# EAGLE design wpf-badge (EAGLE 9.3.0)
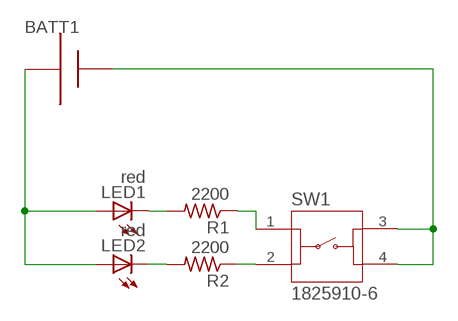
[diagram p0: schematic, sheet 1]

## Parts
BATT1  AAA  [12BH412]
LED1  red  LED3MM  [LED3MM]
LED2  red  LED3MM  [LED3MM]
R1  2200  R-US_0204/7  [0204/7]
R2  2200  R-US_0204/7  [0204/7]
SW1  1825910-6  [SW_1825910-6-4]

## Nets
N$1: LED2.K(C) R2.2
N$2: LED1.K(C) R1.2
N$3: BATT1.+ SW1.3 SW1.4
N$4: R1.1 SW1.1
N$5: R2.1 SW1.2
N$6: BATT1.- LED1.A LED2.A

## Library data of the parts
BATT1 = adafruit:AAA: AAA PC pin holder Mouser part #12BH412 - but pretty much any 1x AAA battery holder should be the same http://www.ladyada.net/library/pcb/eaglelibrary.html
LED1 LED2 = adafruit:LED: LED OSRAM: - CHIPLED LG R971, LG N971, LY N971, LG Q971, LY Q971, LO R971, LY R971 LH N974, LH R974 LS Q976, LO Q976, LY Q976 LO Q996 - Hyper CHIPLED LW Q18S LB Q993, LB Q99A, LB R99A - SideLED LS A670, LO A670, LY A670, LG A670, LP A670 LB A673, LV A673, LT A673, LW A673 LH A674 LY A675 LS A676, LA A676, LO A676, LY A676, LW A676 LS A679, LY A679, LG A679 - Hyper Micro SIDELED® LS Y876, LA Y876, LO Y876, LY Y876 LT Y87S - SmartLED LW L88C, LW L88S LB L89C, LB L89S, LG L890 LS L89K, LO L89K, LY L89K LS L896, LA L896, LO L896, LY L896 - TOPLED LS T670, LO T670, LY T670, LG T670, LP T670 LSG T670, LSP T670, LSY T670, LOP T670, LYG T670 LG T671, LOG T671, LSG T671 LB T673, LV T673, LT T673, LW T673 LH T674 LS T676, LA T676, LO T676, LY T676, LB T676, LH T676, LSB T676, LW T676 LB T67C, LV T67C, LT T67C, LS T67K, LO T67K, LY T67K, LW E67C LS E67B, LA E67B, LO E67B, LY E67B, LB E67C, LV E67C, LT E67C LW T67C LS T679, LY T679, LG T679 LS T770, LO T770, LY T770, LG T770, LP T770 LB T773, LV T773, LT T773, LW T773 LH T774 LS E675, LA E675, LY E675, LS T675 LS T776, LA T776, LO T776, LY T776, LB T776 LHGB T686 LT T68C, LB T68C - Hyper Mini TOPLED® LB M676 - Mini TOPLED Santana® LG M470 LS M47K, LO M47K, LY M47K Source: http://www.osram.convergy.de/
R1 R2 = adafruit:R-US_: RESISTOR, American symbol
SW1 = 1825910-6:1825910-6: Switch Tactile OFF (ON) SPST Round Button PC Pins 0.05A 24VDC 100000Cycles 1.57N Thru-Hole Loose; COMMENT: 1825910-6; CONFIGURATION_POLE-THROW: Single Pole - Single Throw; CONTACT_CURRENT_RATING: 50 mA; DESCRIPTION: FSM4JH=6MM TACT SWITCH, HIGH TEMP; DIGI-KEY_PART_NUMBER: 450-1650-ND; DIGI-KEY_PURCHASE_URL: https://www.digikey.com/product-detail/en/te-connectivity-alcoswitch-switches/1825910-6/450-1650-ND/1632536?utm_source=snapeda&utm_medium=aggregator&utm_campaign=symbol; EU_ROHS_COMPLIANCE: Compliant; MF: TE Connectivity; MP: 1825910-6; PACKAGE: None; TE_PURCHASE_URL: https://www.te.com/usa-en/product-1825910-6.html?te_bu=Cor&te_type=disp&te_campaign=seda_glo_cor-seda-global-disp-prtnr-fy19-seda-model-bom-cta_sma-317_1&elqCampaignId=32493

## Net classes
0 default: width 0.508 mm, drill 0.508 mm, clearance 0.508 mm

## Board
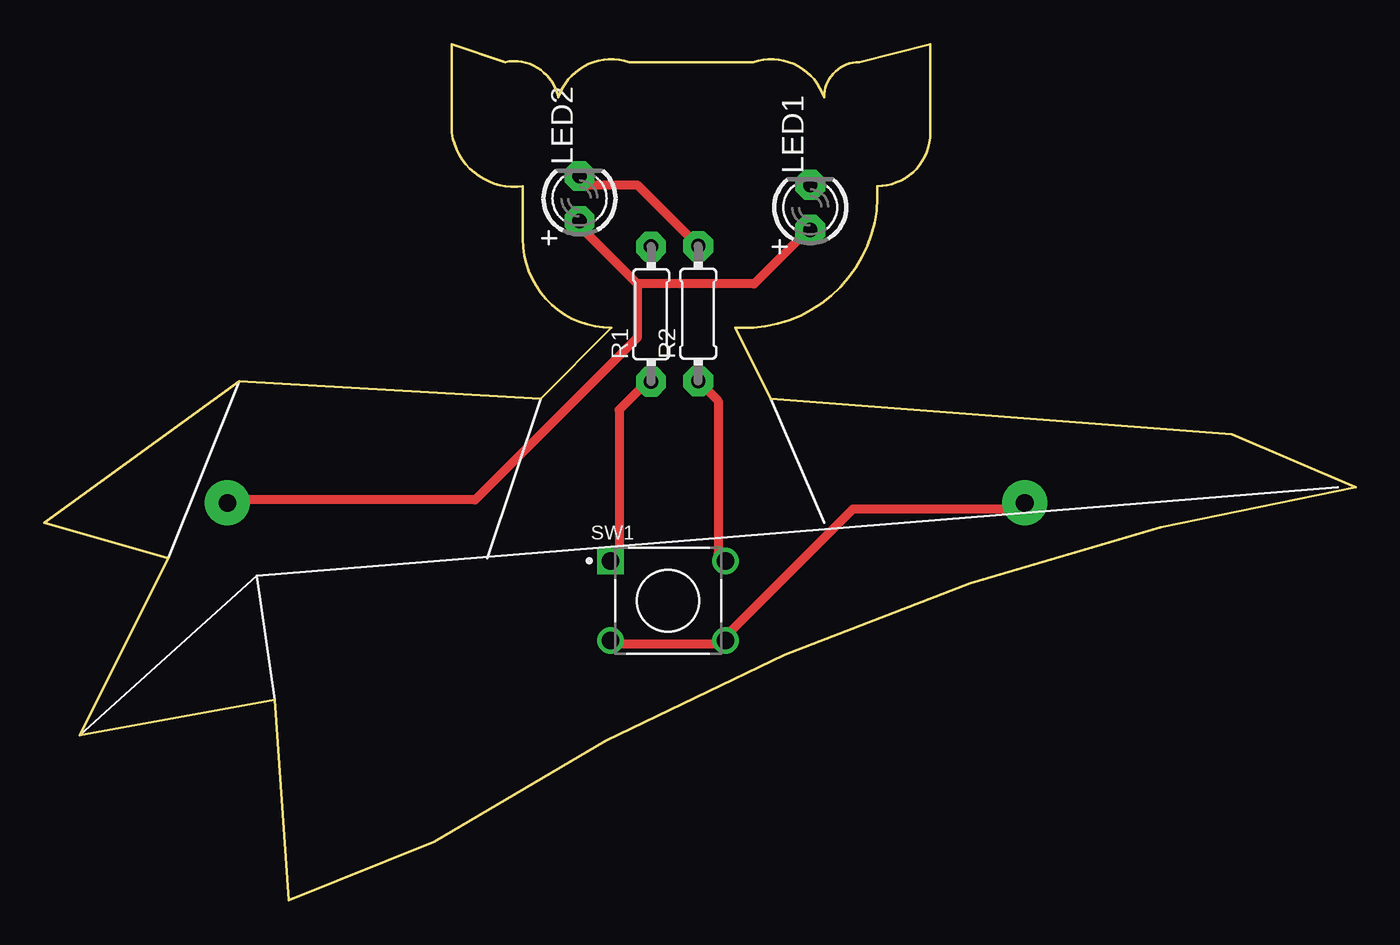
[diagram p1: board, top side]
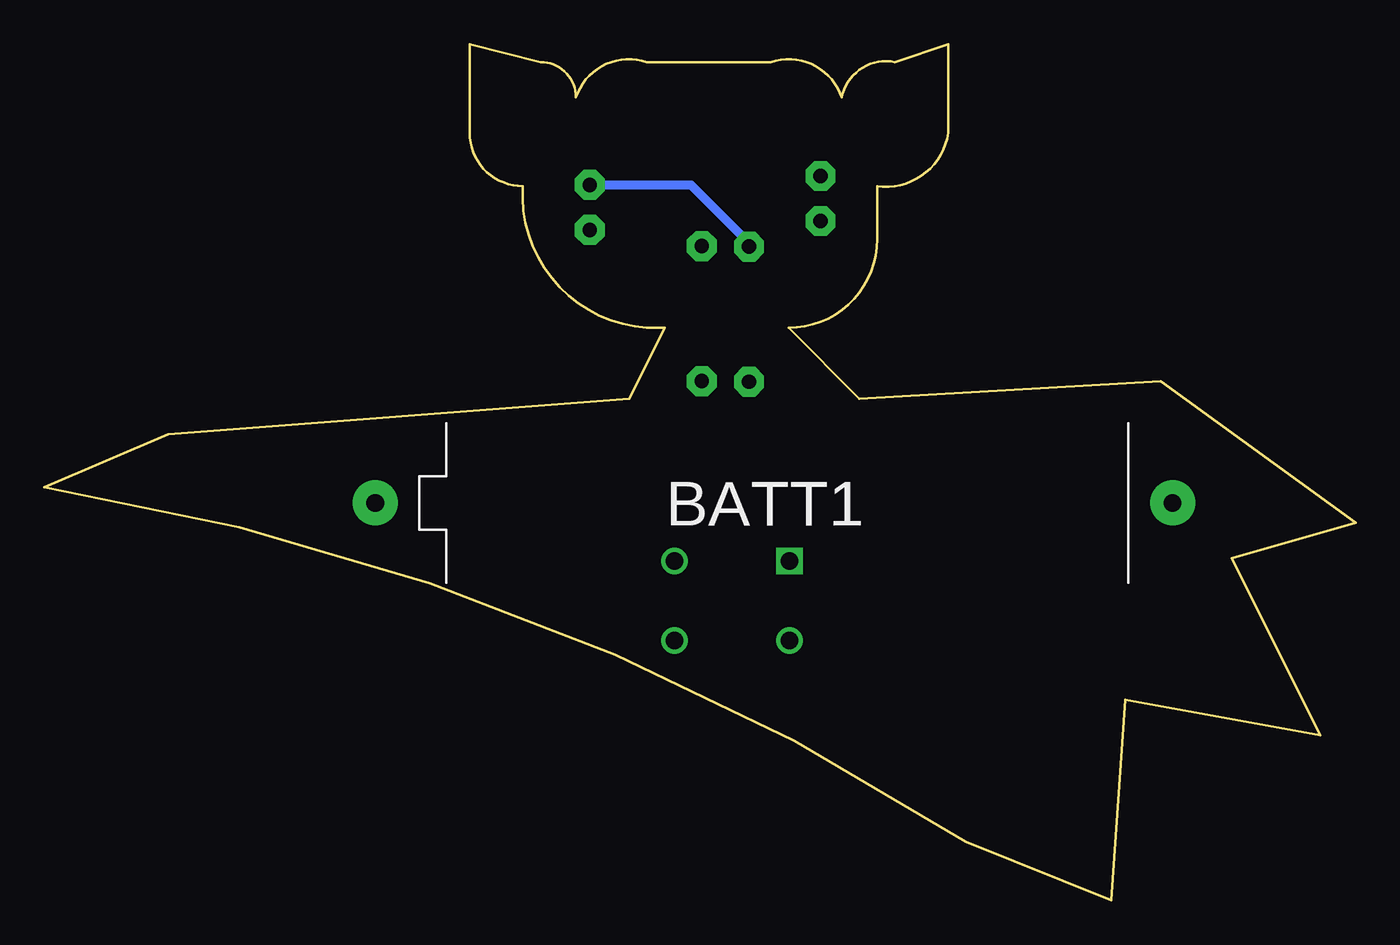
[diagram p2: board, bottom side, seen from below]

Size 74 x 48.3 mm. Coordinates in mm from the lower left corner, seen from the top.
Outline: 13.8,0 22,3.3 arc-24 74,23.3 67,26.3 41,28.3 39,32.3 40,32.3 arc90 47,40.3 arc90 50,43.3 50,48.3 46,47.3 arc90 44,45.3 arc90 40,47.3 33,47.3 arc90 29,45.3 arc90 26,47.3 23,48.3 23,43.3 arc90 27,40.3 27,37.3 arc90 32,32.3 28,28.3 11,29.3 0,21.3 7,19.3 2,9.3 13,11.3 13.8,0
Copper layers (1*16): Top 0.035mm / dielectric 1.5mm / Bottom 0.035mm
Design rules "default": minimum track width 6mil, minimum drill 0.35mm, track to track 6mil, track to pad 6mil, pad to pad 6mil, via to via 6mil, smd to smd 6mil, copper to edge 40mil, drill to drill 6mil, minimum pad ring 10mil, minimum via ring 8mil, stop-mask expansion 4mil, vias tented up to drill 0mil, thermal gap 10mil

### Footprints (pad centres in the part's own frame; a part is rotated, then mirrored left to right if it is on the bottom)
12BH412 = drill 1 pad 2.54: + 22.5,0; - -22.5,0
LED3MM = drill 0.813 pad 1.676 octagon: A -1.27,0; K 1.27,0
0204/7 = drill 0.813 pad 1.676 octagon: 1 -3.81,0; 2 3.81,0
SW_1825910-6-4 = drill 0.99 square: 1 -3.25,2.25 | drill 0.99: 2 3.25,2.25; 3 -3.25,-2.25; 4 3.25,-2.25

### Placement (x,y rotation side)
BATT1  32.83,22.42 180 bottom
LED1  43.22,39.1 90 top
LED2  30.2,39.6 90 top
R1  34.24,33.07 90 top
R2  36.9,33.1 90 top
SW1  35.2,16.9 0 top

### Tracks (layer width: path | path; a pad name or v marks a point on that pad's centre or on a via)
N$1
  Top 0.508: R2.2 36.5,37.32 33.45,40.37 30.4,40.37 LED2.K
N$2
  Bottom 0.508: R1.2 34.46,37.32 37.51,40.37 43.1,40.37 LED1.K
N$3
  Top 0.508: SW1.3 32.43,14.46 38.02,14.46 SW1.4 38.53,14.97 45.64,22.08 55.29,22.08 BATT1.+
N$4
  Top 0.508: SW1.1 32.43,19.54 32.43,27.67 33.96,29.19 R1.1
N$5
  Top 0.508: SW1.2 38.02,19.54 38.02,28.18 37,29.19 R2.1
N$6
  Top 0.508: 33.45,34.78 30.4,37.83 LED2.A | 33.45,34.78 40.05,34.78 43.1,37.83 LED1.A | 33.45,34.78 33.45,31.73 24.3,22.59 10.59,22.59 BATT1.-